# EAGLE schematic Transmitter_Schematic_Visualization (EAGLE 6.5.0)
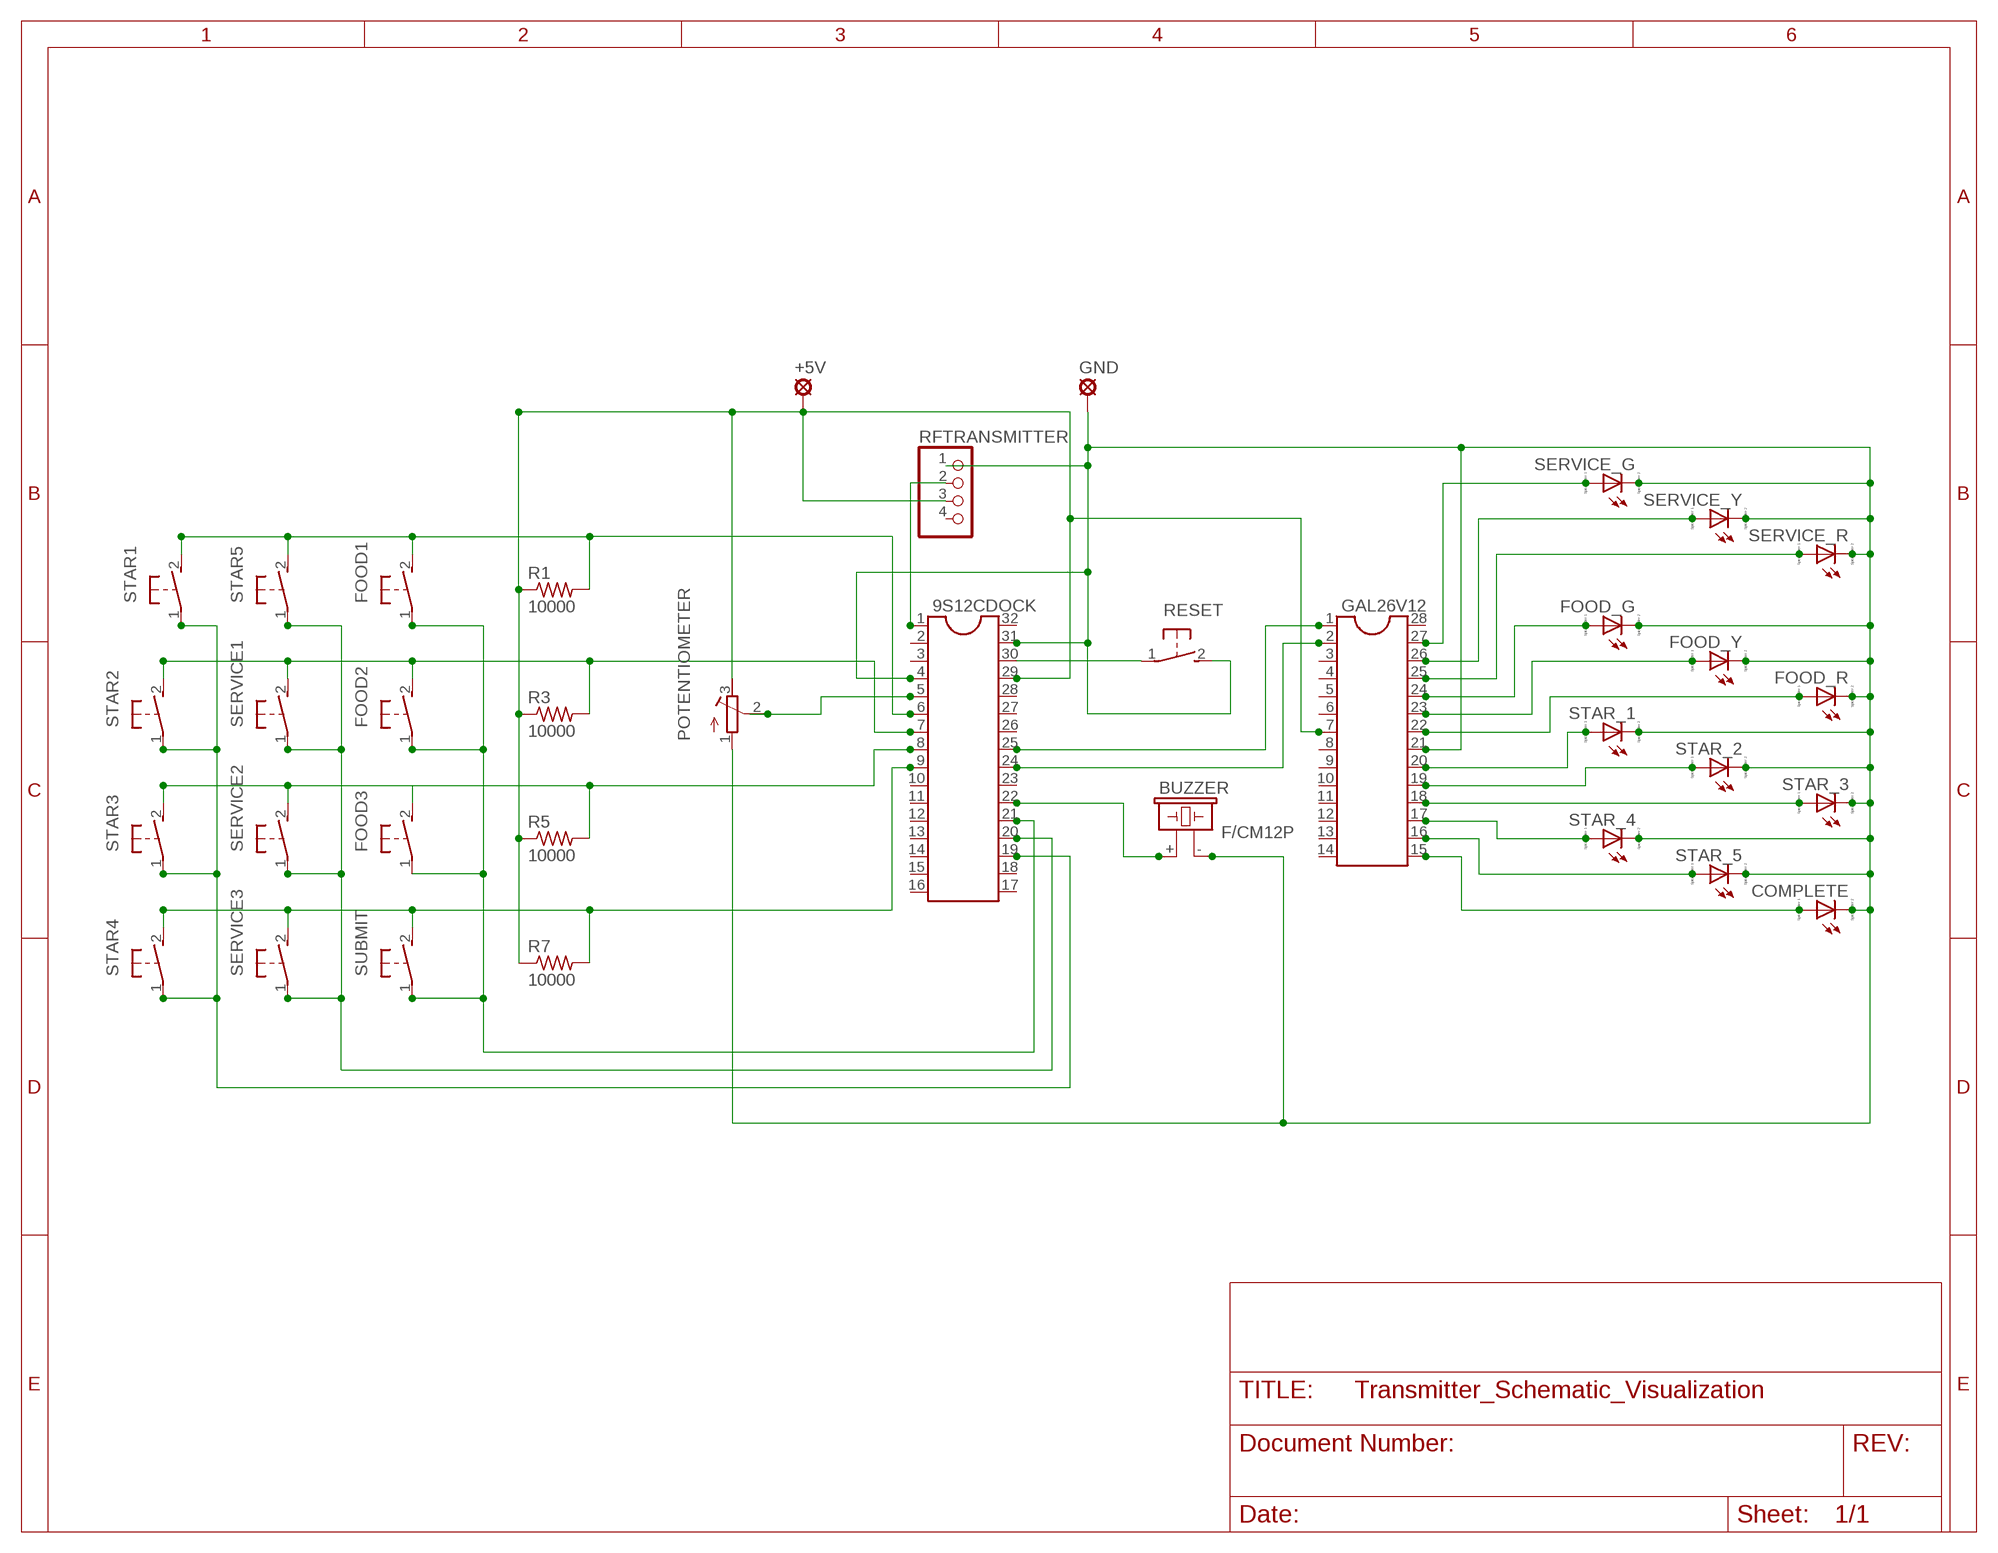
[diagram p0: schematic, sheet 1]

## Parts
9S12CDOCK  DIL32  [DIL32]
+5V  LSP10  [LSP10]
BUZZER  F/CM12P  [F/CM12P]
COMPLETE  LED_E  [LED_1206]
FOOD1  31-XX  [B3F-31XX]
FOOD2  31-XX  [B3F-31XX]
FOOD3  31-XX  [B3F-31XX]
FOOD_G  LED_E  [LED_1206]
FOOD_R  LED_E  [LED_1206]
FOOD_Y  LED_E  [LED_1206]
GAL26V12  DIL28  [DIL28-6]
GND  LSP10  [LSP10]
POTENTIOMETER  R-TRIMM3296X  [RTRIM3296X]
R1  10000  R-US_0204/5  [0204/5]
R3  10000  R-US_0204/5  [0204/5]
R5  10000  R-US_0204/5  [0204/5]
R7  10000  R-US_0204/5  [0204/5]
RESET  31-XX  [B3F-31XX]
RFTRANSMITTER  PINHD-1X4  [1X04]
SERVICE1  31-XX  [B3F-31XX]
SERVICE2  31-XX  [B3F-31XX]
SERVICE3  31-XX  [B3F-31XX]
SERVICE_G  LED_E  [LED_1206]
SERVICE_R  LED_E  [LED_1206]
SERVICE_Y  LED_E  [LED_1206]
STAR1  31-XX  [B3F-31XX]
STAR2  31-XX  [B3F-31XX]
STAR3  31-XX  [B3F-31XX]
STAR4  31-XX  [B3F-31XX]
STAR5  31-XX  [B3F-31XX]
STAR_1  LED_E  [LED_1206]
STAR_2  LED_E  [LED_1206]
STAR_3  LED_E  [LED_1206]
STAR_4  LED_E  [LED_1206]
STAR_5  LED_E  [LED_1206]
SUBMIT  31-XX  [B3F-31XX]

## Nets
N$1: 9S12CDOCK.1 RFTRANSMITTER.2
N$2: 9S12CDOCK.7 FOOD2.2(S) R3.2 SERVICE1.2(S) STAR2.2(S)
N$3: 9S12CDOCK.8 FOOD3.2(S) R5.2 SERVICE2.2(S) STAR3.2(S)
N$4: 9S12CDOCK.9 R7.2 SERVICE3.2(S) STAR4.2(S) SUBMIT.2(S)
N$5: 9S12CDOCK.20 SERVICE1.1(P) SERVICE2.1(P) SERVICE3.1(P) STAR5.1(P)
N$6: GAL26V12.27 SERVICE_G.A
N$7: 9S12CDOCK.21 FOOD1.1(P) FOOD2.1(P) FOOD3.1(P) SUBMIT.1(P)
N$8: 9S12CDOCK.6 FOOD1.2(S) R1.2 STAR1.2(S) STAR5.2(S)
N$9: 9S12CDOCK.19 STAR1.1(P) STAR2.1(P) STAR3.1(P) STAR4.1(P)
N$10: 9S12CDOCK.30 RESET.1(P)
N$11: 9S12CDOCK.25 GAL26V12.1
N$12: 9S12CDOCK.24 GAL26V12.2
N$13: 9S12CDOCK.29 +5V.MP GAL26V12.7 POTENTIOMETER.3(A) R1.1 R3.1 R5.1 R7.1 RFTRANSMITTER.3
N$14: FOOD_G.A GAL26V12.24
N$15: FOOD_Y.A GAL26V12.23
N$16: FOOD_R.A GAL26V12.22
N$17: GAL26V12.20 STAR_1.A
N$18: GAL26V12.19 STAR_2.A
N$19: GAL26V12.17 STAR_4.A
N$20: GAL26V12.18 STAR_3.A
N$21: COMPLETE.A GAL26V12.15
N$22: GAL26V12.16 STAR_5.A
N$23: GAL26V12.26 SERVICE_Y.A
N$24: GAL26V12.25 SERVICE_R.A
N$25: 9S12CDOCK.22 BUZZER.+
N$26: 9S12CDOCK.5 POTENTIOMETER.2(S)
N$28: 9S12CDOCK.4 9S12CDOCK.31 BUZZER.- COMPLETE.C FOOD_G.C FOOD_R.C FOOD_Y.C GAL26V12.21 GND.MP POTENTIOMETER.1(E) RESET.2(S) RFTRANSMITTER.1 SERVICE_G.C SERVICE_R.C SERVICE_Y.C STAR_1.C STAR_2.C STAR_3.C STAR_4.C STAR_5.C
Unconnected: 9S12CDOCK.2 9S12CDOCK.3 9S12CDOCK.10 9S12CDOCK.11 9S12CDOCK.12 9S12CDOCK.13 9S12CDOCK.14 9S12CDOCK.15 9S12CDOCK.16 9S12CDOCK.17 9S12CDOCK.18 9S12CDOCK.23 9S12CDOCK.26 9S12CDOCK.27 9S12CDOCK.28 9S12CDOCK.32 GAL26V12.3 GAL26V12.4 GAL26V12.5 GAL26V12.6 GAL26V12.8 GAL26V12.9 GAL26V12.10 GAL26V12.11 GAL26V12.12 GAL26V12.13 GAL26V12.14 GAL26V12.28 RFTRANSMITTER.4

## Library data of the parts
9S12CDOCK = ic-package:DIL32: Dual In Line
+5V GND = solpad:LSP10: SOLDER PAD drill 1.0 mm, distributor Buerklin, 12H555
BUZZER = buzzer:F/CM12P: BUZZER Source: Buerklin; OC_FARNELL: unknown; OC_NEWARK: unknown
COMPLETE FOOD_G FOOD_R FOOD_Y SERVICE_G SERVICE_R SERVICE_Y STAR_1-STAR_5 = eagle-ltspice:LED_E: LED Source: http://www.osram.convergy.de Source: www.luxeon.com Source: www.kingbright.com; SPICEMODEL: NONE; SPICEPREFIX: D; SPICETYPE: diode
FOOD1-FOOD3 RESET SERVICE1-SERVICE3 STAR1-STAR5 SUBMIT = switch-omron:31-XX: OMRON SWITCH; MPN: B3F-3100; OC_FARNELL: 959704; OC_NEWARK: 36M3582
GAL26V12 = ic-package:DIL28: Dual In Line
POTENTIOMETER = resistor:R-TRIMM: Trimm resistor
R1 R3 R5 R7 = resistor:R-US_: RESISTOR, American symbol
RFTRANSMITTER = pinhead:PINHD-1X4: PIN HEADER